# Altium project Glove_PCB.PrjPcb
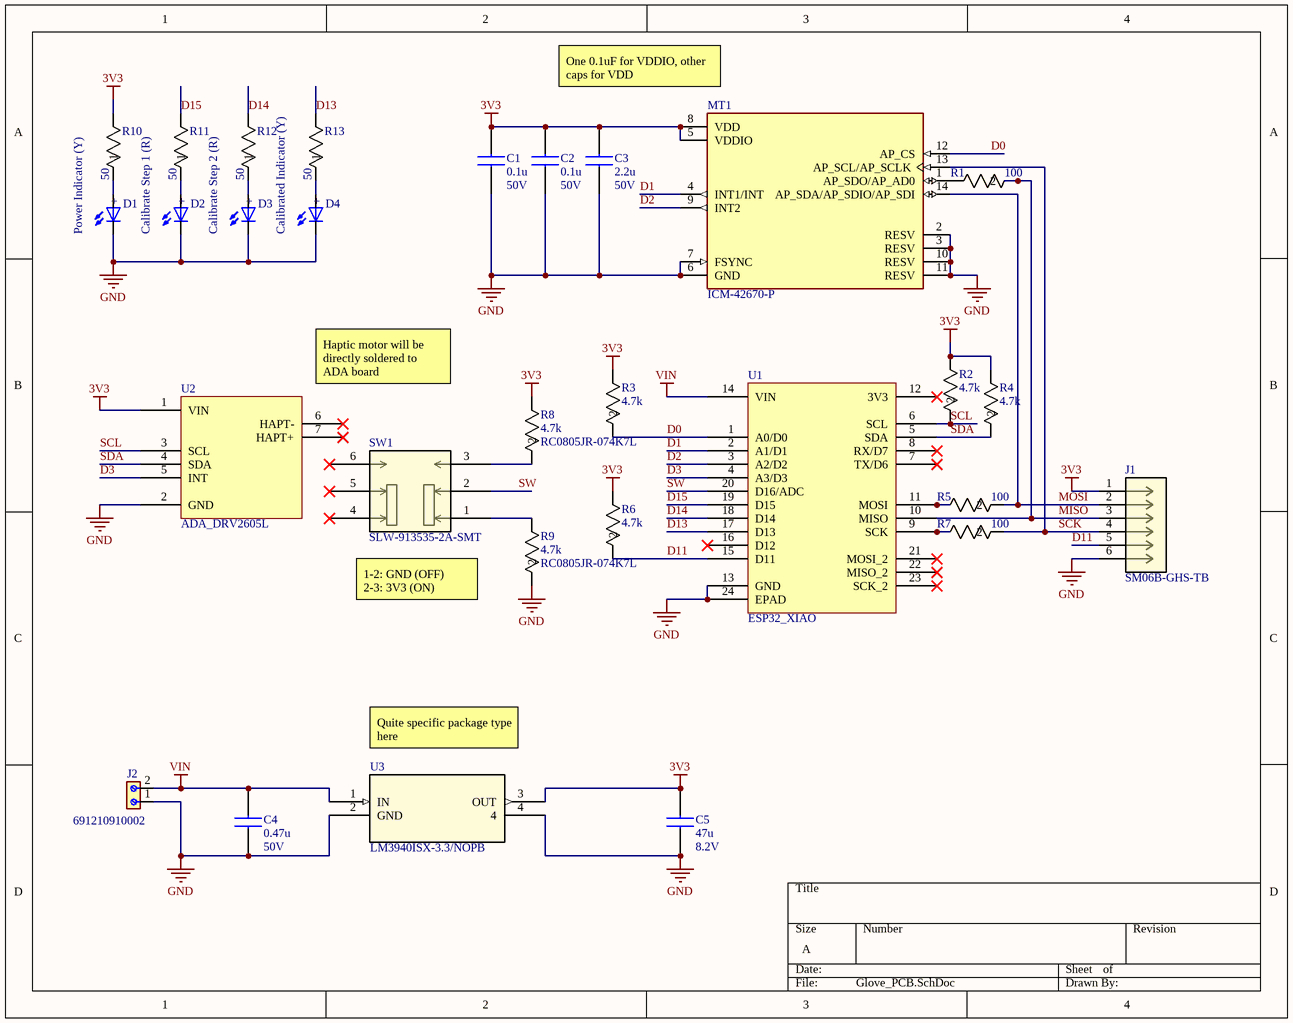
[diagram p0: Glove_PCB.SchDoc]
CAGE_CODE: ?????; CONTRACT_NUMBER: <CONTRACT NO>; DOC_NO_ASSY_DWG: <ASSY DWG NO>; DOC_NO_BOM: <BOM DOC NO>; DOC_NO_FAB_DWG: <FAB DWG NO>; DOC_NO_SCH_DWG: <SCH DWG NO>; PCB_2_DEC_TOL: +/-.01; PCB_3_DEC_TOL: +/-.010; PCB_ANG_TOL: +/-1/2; PCB_ASSEMBLY_NO: <PCB ASSY NO>; PCB_CHECKER: - -----; PCB_CHECKER_APP_DATE: --/--/----; PCB_DESIGNER: - -----; PCB_DESIGNER_APP_DATE: --/--/----; PCB_DWG_NO: <PCB DWG NO>; PCB_ENGINEER: - -----; PCB_ENGINEER_APP_DATE: --/--/----; PCB_PART_NUMBER: <PCB PN>; PCB_REV: A; SCH_REV: A
1 sheet, 29 parts. Net scope: strictly hierarchical (ports join the sheet entries above them; power ports are local).
Board file: Glove_PCB.PcbDoc

## Sheet Glove_PCB.SchDoc
size A; SheetNumber: 1; SheetTotal: 1

### Parts
C1  value 0.1u  Rated Voltage: 50V  [CAPC2012X145N]  (hidden comment: KAM21BR71H104JM)
C2  value 0.1u  Rated Voltage: 50V  [CAPC2012X145N]  (hidden comment: KAM21BR71H104JM)
C3  value 2.2u  Rated Voltage: 50V  [CAPC2012X145N]  (hidden comment: C2012X7R1H225K125AE)
C4  value 0.47u  Rated Voltage: 50V  [CAPC2012X145N]  (hidden comment: GCM21BR71H474KA55K)
C5  value 47u  Rated Voltage: 8.2V  [CAPC2012X145N]  (hidden comment: T58W0476M8R2C0500)
D1  WL-SMCW_0603  [WL-SMCW_0603]  (value not drawn)
D2  WL-SMCW_0603  [WL-SMCW_0603]  (value not drawn)
D3  WL-SMCW_0603  [WL-SMCW_0603]  (value not drawn)
D4  WL-SMCW_0603  [WL-SMCW_0603]  (value not drawn)
J1  SM06B-GHS-TB  [CONN_SM06B-GHS-TB_JST]
J2  691210910002  [691210910002]
MT1  ICM-42670-P  [XDCR_ICM-42670-P]
R1  value 100  [RC0805N_YAG]  (hidden comment: RC0805JR-07100RL)
R2  value 4.7k  [RC0805N_YAG]  (hidden comment: RC0805JR-074K7L)
R3  value 4.7k  [RC0805N_YAG]  (hidden comment: RC0805JR-074K7L)
R4  value 4.7k  [RC0805N_YAG]  (hidden comment: RC0805JR-074K7L)
R5  value 100  [RC0805N_YAG]  (hidden comment: RC0805JR-07100RL)
R6  value 4.7k  [RC0805N_YAG]  (hidden comment: RC0805JR-074K7L)
R7  value 100  [RC0805N_YAG]  (hidden comment: RC0805JR-07100RL)
R8  RC0805JR-074K7L  value 4.7k  [RC0805N_YAG]
R9  RC0805JR-074K7L  value 4.7k  [RC0805N_YAG]
R10  value 50  [RES_RT0603_YAG]  (hidden comment: RT0603BRD0750RL)
R11  value 50  [RES_RT0603_YAG]  (hidden comment: RT0603BRD0750RL)
R12  value 50  [RES_RT0603_YAG]  (hidden comment: RT0603BRD0750RL)
R13  value 50  [RES_RT0603_YAG]  (hidden comment: RT0603BRD0750RL)
SW1  SLW-913535-2A-SMT  [SLW-913535_CUD]
U1  ESP32_XIAO  [MOUDLE23P-SMD-2.54-21X17.8MM.kicad_mod.kicad_sym]
U2  ADA_DRV2605L  [ADA_DRV2605L]
U3  LM3940ISX-3.3/NOPB  [TS3B]

### Nets
3V3: C1.2 C2.2 C3.2 C5.2 J1.1 MT1.5(VDDIO) MT1.8(VDD) R2.1 R3.1 R4.1 R6.1 R8.1 R10.2 U2.1(VIN) U3.3(OUT)
GND: C1.1 C2.1 C3.1 C4.1 C5.1 D1.1(NEG) D2.1(NEG) D3.1(NEG) D4.1(NEG) J1.6 J2.1 MT1.2(RESV) MT1.3(RESV) MT1.6(GND) MT1.7(FSYNC) MT1.10(RESV) MT1.11(RESV) R9.2 U1.13(GND) U1.24(EPAD) U2.2(GND) U3.2(GND) U3.4
VIN: C4.2 J2.2 U1.14(VIN) U3.1(IN)
D0: MT1.12(AP_CS) R3.2 U1.1(A0/D0)
D1: MT1.4(INT1/INT) U1.2(A1/D1)
D2: MT1.9(INT2) U1.3(A2/D2)
D3: U1.4(A3/D3) U2.5(INT)
D11: J1.5 R6.2 U1.15(D11)
D13: R13.2 U1.17(D13)
D14: R12.2 U1.18(D14)
D15: R11.2 U1.19(D15)
MISO: J1.3 R1.2 U1.10(MISO)
MOSI: J1.2 MT1.14(AP_SDA/AP_SDIO/AP_SDI) R5.2
SCK: J1.4 MT1.13(AP_SCL/AP_SCLK) R7.2
SCL: R2.2 U1.6(SCL) U2.3(SCL)
SDA: R4.2 U1.5(SDA) U2.4(SDA)
SW: SW1.2 U1.20(D16/ADC)
NetD1_2: D1.2(POS) R10.1
NetD2_2: D2.2(POS) R11.1
NetD3_2: D3.2(POS) R12.1
NetD4_2: D4.2(POS) R13.1
NetMT1_1: MT1.1(AP_SDO/AP_AD0) R1.1
NetR5_1: R5.1 U1.11(MOSI)
NetR7_1: R7.1 U1.9(SCK)
NetR8_2: R8.2 SW1.3
NetR9_1: R9.1 SW1.1

Not connected (* = marked no-connect by the designer): SW1 4* 5* 6*; U1 7(TX/D6)* 8(RX/D7)* 12(3V3)* 16(D12)* 21(MOSI_2)* 22(MISO_2)* 23(SCK_2)*; U2 6(HAPT-)* 7(HAPT+)*

### Notes on the sheet
- (near MT1) One 0.1uF for VDDIO, other caps for VDD
- Power Indicator (Y)
- Calibrate Step 1 (R)
- Calibrate Step 2 (R)
- Calibrated Indicator (Y)
- (near U2) Haptic motor will be directly soldered to ADA board
- 1-2: GND (OFF)
  2-3: 3V3 (ON)
- Quite specific package type here
- (in symbol WL-SMCW_0603) +

### Library data of the parts
C1 C2 = KAM21BR71H104JM: Multilayer Ceramic Chip Capacitors, Capacitance=0.1u; Manufacturer_Part_Number: KAM21BR71H104JM
C3 = C2012X7R1H225K125AE: Multilayer Ceramic Chip Capacitors, Capacitance=2.2u; Manufacturer_Part_Number: C2012X7R1H225K125AE
C4 = GCM21BR71H474KA55K: Multilayer Ceramic Chip Capacitors, Capacitance=0.47u; Manufacturer_Part_Number: GCM21BR71H474KA55K
C5 = T58W0476M8R2C0500: 47 µF Molded Tantalum Polymer Capacitor 8.2 V 0805 (2012 Metric) 500mOhm @ 100kHz; Manufacturer_Part_Number: T58W0476M8R2C0500
D1 D4 = WL-SMCW_0603: 0603, Yellow Typ.(@20mA): 590nm, 120mcd, 2.0V, 140Â° AlInGaP; MF: Wurth Electronics; MP: 150060YS75000; SnapEDA_Link: https://www.snapeda.com/parts/150060YS75000/Wurth+Electronics/view-part/?ref=snap; Package: 0603 Wurth Electronics; Value: *; Check_prices: https://www.snapeda.com/parts/150060YS75000/Wurth+Electronics/view-part/?ref=eda
D2 D3 = WL-SMCW_0603: 0603, Super Red Typ.(@20mA): 630nm, 60mcd, 1.9V, 140Â° AlInGaP; MF: Wurth Electronics; MP: 150060SS75000; SnapEDA_Link: https://www.snapeda.com/parts/150060SS75000/Wurth+Electronics/view-part/?ref=snap; Package: 0603 WÃ¼rth Elektronik; Value: *; Check_prices: https://www.snapeda.com/parts/150060SS75000/Wurth+Electronics/view-part/?ref=eda
J1 = SM06B-GHS-TB: No Description Available; Manufacturer_Name: JST; Copyright: Copyright (C) 2025 Ultra Librarian. All rights reserved.; Manufacturer_Part_Number: SM06B-GHS-TB; RefDes: RefDes; Type: Type
J2 = 691210910002: MF: {'manufacturer': u'W\xfcrth Elektronik'}; Package: None; Price: None; Value: *; MP: 691210910002; Availability: Unavailable
R1 R5 R7 = RC0805JR-07100RL: RES 0805 100 5% 1/8W; Manufacturer_Name: Yageo; Manufacturer_Part_Number: RC0805JR-07100RL; Tolerance: 5%
R2-R4 R6 R8 R9 = RC0805JR-074K7L: RES 0805 4.7k 5% 1/8W; Manufacturer_Name: Yageo; Manufacturer_Part_Number: RC0805JR-074K7L; Tolerance: 5%
R10-R13 = RT0603BRD0750RL: No Description Available; Manufacturer_Name: Yageo; Copyright: Copyright (C) 2025 Ultra Librarian. All rights reserved.; Manufacturer_Part_Number: RT0603BRD0750RL
SW1 = SLW-913535-2A-SMT: No Description Available; Manufacturer_Name: Same Sky; Type: Slide Switches; Copyright: Copyright (C) 2025 Ultra Librarian. All rights reserved.; Manufacturer_Part_Number: SLW-913535-2A-SMT; RefDes: RefDes
U3 = LM3940ISX-3.3NOPB: 1-A, low-dropout voltage regulator for 5-V to 3.3-V conversion 3-DDPAK/TO-263 -40 to 125; Manufacturer_Name: Texas Instruments; Type: LM3940IS-3.3; Copyright: Copyright (C) 2025 Ultra Librarian. All rights reserved.; Manufacturer_Part_Number: LM3940ISX-3.3/NOPB; Datasheet: https://www.ti.com/lit/gpn/lm3940; RefDes: RefDes
MT1 = ICM-42670-P: Package: None; Price: None; Value: *; MP: ICM-42670-P; Availability: Unavailable

## Assembly variants
Manufacture: not fitted U1